# Altium schematic sheet [3] Gate_Drivers.SchDoc
size A4; SheetNumber: 4; SheetTotal: 5
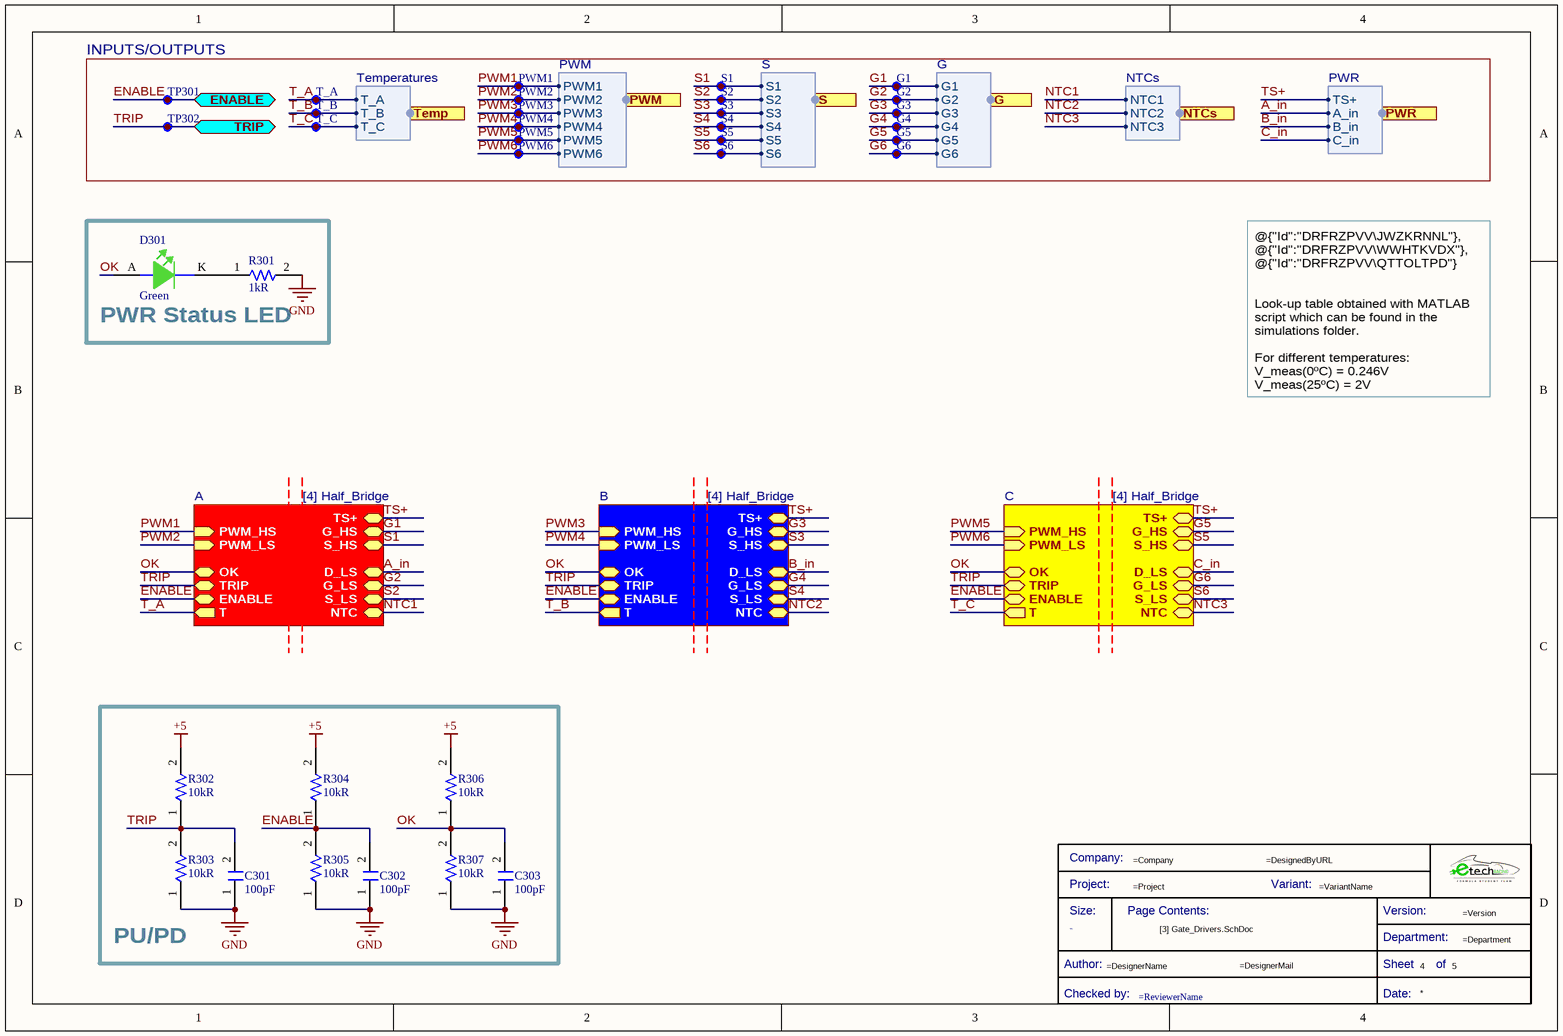
[diagram p0: [3] Gate_Drivers.SchDoc]

## Parts
*?  Title Block_template  (value not drawn)  (graphical)
C301  Capacitance: 100pF  [C0805FNPC-W]  (hidden comment: 885012007057)
C302  Capacitance: 100pF  [C0805FNPC-W]  (hidden comment: 885012007057)
C303  Capacitance: 100pF  [C0805FNPC-W]  (hidden comment: 885012007057)
D301  Color: Green  [LED_0805_WE]  (hidden comment: 150080GS75000)
G1  TestPoint  [TestPoint]  (value not drawn)  (no BOM)
G2  TestPoint  [TestPoint]  (value not drawn)  (no BOM)
G3  TestPoint  [TestPoint]  (value not drawn)  (no BOM)
G4  TestPoint  [TestPoint]  (value not drawn)  (no BOM)
G5  TestPoint  [TestPoint]  (value not drawn)  (no BOM)
G6  TestPoint  [TestPoint]  (value not drawn)  (no BOM)
PWM1  TestPoint  [TestPoint]  (value not drawn)  (no BOM)
PWM2  TestPoint  [TestPoint]  (value not drawn)  (no BOM)
PWM3  TestPoint  [TestPoint]  (value not drawn)  (no BOM)
PWM4  TestPoint  [TestPoint]  (value not drawn)  (no BOM)
PWM5  TestPoint  [TestPoint]  (value not drawn)  (no BOM)
PWM6  TestPoint  [TestPoint]  (value not drawn)  (no BOM)
R301  Resistance: 1kR  [R0805FTK]  (hidden comment: CR0805-JW-102ELF)
R302  Resistance: 10kR  [R0805FTK]  (hidden comment: CR0805-JW-103ELF)
R303  Resistance: 10kR  [R0805FTK]  (hidden comment: CR0805-JW-103ELF)
R304  Resistance: 10kR  [R0805FTK]  (hidden comment: CR0805-JW-103ELF)
R305  Resistance: 10kR  [R0805FTK]  (hidden comment: CR0805-JW-103ELF)
R306  Resistance: 10kR  [R0805FTK]  (hidden comment: CR0805-JW-103ELF)
R307  Resistance: 10kR  [R0805FTK]  (hidden comment: CR0805-JW-103ELF)
S1  TestPoint  [TestPoint]  (value not drawn)  (no BOM)
S2  TestPoint  [TestPoint]  (value not drawn)  (no BOM)
S3  TestPoint  [TestPoint]  (value not drawn)  (no BOM)
S4  TestPoint  [TestPoint]  (value not drawn)  (no BOM)
S5  TestPoint  [TestPoint]  (value not drawn)  (no BOM)
S6  TestPoint  [TestPoint]  (value not drawn)  (no BOM)
T_A  TestPoint  [TestPoint]  (value not drawn)  (no BOM)
T_B  TestPoint  [TestPoint]  (value not drawn)  (no BOM)
T_C  TestPoint  [TestPoint]  (value not drawn)  (no BOM)
TP301  TestPoint  [TestPoint]  (value not drawn)  (no BOM)
TP302  TestPoint  [TestPoint]  (value not drawn)  (no BOM)

## Blocks framed on the sheet
INPUTS/OUTPUTS: G1-G6 PWM1-PWM6 S1-S6 T_A T_B T_C TP301 TP302
PWR Status LED: D301 R301
PU/PD: C301-C303 R302-R307

## Sub-sheets
A = [4] Half_Bridge: PWM_HS (in), G_HS (bidir), S_HS (bidir), PWM_LS (in), G_LS (bidir), S_LS (bidir), NTC (bidir), OK (bidir), TRIP (bidir), ENABLE (bidir), T (out), D_LS (bidir), TS+ (bidir)
B = [4] Half_Bridge: PWM_HS (in), G_HS (bidir), S_HS (bidir), PWM_LS (in), G_LS (bidir), S_LS (bidir), NTC (bidir), OK (bidir), TRIP (bidir), ENABLE (bidir), T (out), TS+ (bidir), D_LS (bidir)
C = [4] Half_Bridge: PWM_HS (in), G_HS (bidir), S_HS (bidir), PWM_LS (in), G_LS (bidir), S_LS (bidir), NTC (bidir), OK (bidir), TRIP (bidir), ENABLE (bidir), T (out), TS+ (bidir), D_LS (bidir)

## Ports
ENABLE (bidir, see Inverter_Power[2C], [4] Half_Bridge[1B]), G (harness G, see Inverter_Power[3C], [1] Power_Stage[1C]), NTCs (harness NTCs, see Inverter_Power[3C], [1] Power_Stage[1B]), PWM (harness PWM, see Inverter_Power[2C]), PWR (harness PWR, see Inverter_Power[3B]), S (harness S, see Inverter_Power[3C], [1] Power_Stage[1C]), Temp (harness Temperatures, see Inverter_Power[2C]), TRIP (bidir, see Inverter_Power[2C], [4] Half_Bridge[1B])

## Harnesses
PWM: PWM1, PWM2, PWM3, PWM4, PWM5, PWM6
S: S1, S2, S3, S4, S5, S6
G: G1, G2, G3, G4, G5, G6
NTCs: NTC1, NTC2, NTC3
Temperatures: T_A, T_B, T_C
PWR: TS+, A_in, B_in, C_in

## Nets
+5: R302.2 R304.2 R306.2
GND: C301.1 C302.1 C303.1 R301.2 R303.1 R305.1 R307.1
A_in: sheet A/D_LS, port PWR.A_in
B_in: sheet B/D_LS, port PWR.B_in
C_in: sheet C/D_LS, port PWR.C_in
ENABLE: C302.2 R304.1 R305.2 TP301.1(TP) ; port ENABLE, sheet A/ENABLE, sheet B/ENABLE, sheet C/ENABLE
G1: G1.1(TP) ; sheet A/G_HS, port G.G1
G2: G2.1(TP) ; sheet A/G_LS, port G.G2
G3: G3.1(TP) ; sheet B/G_HS, port G.G3
G4: G4.1(TP) ; sheet B/G_LS, port G.G4
G5: G5.1(TP) ; sheet C/G_HS, port G.G5
G6: G6.1(TP) ; sheet C/G_LS, port G.G6
NTC1: sheet A/NTC, port NTCs.NTC1
NTC2: sheet B/NTC, port NTCs.NTC2
NTC3: sheet C/NTC, port NTCs.NTC3
OK: C303.2 D301.A R306.1 R307.2 ; sheet A/OK, sheet B/OK, sheet C/OK
PWM1: PWM1.1(TP) ; sheet A/PWM_HS, port PWM.PWM1
PWM2: PWM2.1(TP) ; sheet A/PWM_LS, port PWM.PWM2
PWM3: PWM3.1(TP) ; sheet B/PWM_HS, port PWM.PWM3
PWM4: PWM4.1(TP) ; sheet B/PWM_LS, port PWM.PWM4
PWM5: PWM5.1(TP) ; sheet C/PWM_HS, port PWM.PWM5
PWM6: PWM6.1(TP) ; sheet C/PWM_LS, port PWM.PWM6
S1: S1.1(TP) ; sheet A/S_HS, port S.S1
S2: S2.1(TP) ; sheet A/S_LS, port S.S2
S3: S3.1(TP) ; sheet B/S_HS, port S.S3
S4: S4.1(TP) ; sheet B/S_LS, port S.S4
S5: S5.1(TP) ; sheet C/S_HS, port S.S5
S6: S6.1(TP) ; sheet C/S_LS, port S.S6
T_A: T_A.1(TP) ; sheet A/T, port Temp.T_A
T_B: T_B.1(TP) ; sheet B/T, port Temp.T_B
T_C: T_C.1(TP) ; sheet C/T, port Temp.T_C
TRIP: C301.2 R302.1 R303.2 TP302.1(TP) ; port TRIP, sheet A/TRIP, sheet B/TRIP, sheet C/TRIP
TS+: sheet A/TS+, sheet B/TS+, sheet C/TS+, port PWR.TS+
NetD301_K: D301.K R301.1

## Notes on the sheet
- @{"Id":"DRFRZPVV\JWZKRNNL"}, @{"Id":"DRFRZPVV\WWHTKVDX"}, @{"Id":"DRFRZPVV\QTTOLTPD"}
  Look-up table obtained with MATLAB script which can be found in the simulations folder.
  For different temperatures:
  V_meas(0ºC) = 0.246V
  V_meas(25ºC) = 2V
  V_meas(50ºC) = 2.578V
  V_meas(90ºC) = 2.864V
- (in symbol Title Block_template) Company:; Project:; Variant:; Size:; Page Contents:; Version:; Department:; Author:; Sheet; of; Checked by:; Date:

## Library data of the parts
*? = Title Block_template: Standard Title Block; .Creator: GP; Category: Title Block; .PCBcheck: GP; .SCHcheck: GP; Checked by:: =ReviewerName; Size: -
C301-C303 = C100p-50V-0805FNPC-C0G/NP0: Multilayer Ceramic Capacitor, Wcap-Csgp Series, 100 Pf, 5%, C0G / Np0, 50 V, 0805 [2012 Metric] Rohs Compliant: Yes; Manufacturer: Wurth Electronics; Voltage Rating: 50V; .Creator: DR; Supplier 1: RSComponents; Manufacturer Part Number: 885012007057; RoHS: Yes; Category: Ceramic Capacitors; Stock 1: 1; Pricing 1: 4000=0,03900, 12000=0,03800 (USD); Mount: Surface Mount; Case/Package: 0805; Case Code (Metric): 2012; Case Code (Imperial): 0805; Min Operating Temperature: -55°C; Max Operating Temperature: 125°C; Packaging: Cut Tape; Dielectric: C0G; Tolerance: 5%; Voltage Rating (DC): 50V; Length: 0.079inch; Width: 0.049inch; Thickness: 0.035inch; REACH SVHC: Unknown; RoHS Compliant: Yes; ComponentLink1URL: http://www.farnell.com/datasheets/1958443.pdf?src-supplier=Farnell; ComponentLink1Description: http://www.farnell.com/datasheets/1958443.pdf?src-supplier=Farnell; ComponentLink2URL: https://katalog.we-online.de/pbs/datasheet/885012007057.pdf?src-supplier=Digi-Key; ComponentLink2Description: https://katalog.we-online.de/pbs/datasheet/885012007057.pdf?src-supplier=Digi-Key; ComponentLink3URL: http://www.farnell.com/datasheets/1958443.pdf?src-supplier=Element14; ComponentLink3Description: http://www.farnell.com/datasheets/1958443.pdf?src-supplier=Element14; ComponentLink4URL: http://www.farnell.com/datasheets/1958443.pdf?src-supplier=Newark; ComponentLink4Description: http://www.farnell.com/datasheets/1958443.pdf?src-supplier=Newark; ComponentLink5Description: Where buy it; ComponentLink5URL: https://www.we-online.com/catalog/en/WCAP-CSGP-50VDC#885012007057; Supplier Part Number 1: 1813930
D301 = LEDGS-0805-450: Led, Green, 520 Nm, 3.2 V, 30 Ma, 450 Mcd Rohs Compliant: Yes; Manufacturer 1: Wurth Electronics; Viewing Angle: 140°; Lens Style: Clear,Rectangular; Luminous Intensity: 450mcd; Forward Voltage: 3.2V; Wavelength: 520nm; Forward Current: 30mA; Test Current: 20mA; .Creator: GP; ComponentLink1Description: Datasheet; ComponentLink1URL: https://www.we-online.com/catalog/datasheet/150080GS75000.pdf; ComponentLink2Description: Where buy it; ComponentLink2URL: https://katalog.we-online.de/en/led/WL-SMCW/150080GS75000; Supplier 1: RSComponents; Manufacturer Part Number 1: 150080GS75000; RoHS: Yes; Category: LEDs; Stock 1: 4350; Pricing 1: 50=0,19300, 500=0,12900, 1000=0,12300, 2000=0,11700, 4000=0,11100 (USD); Mount: Surface Mount; Case/Package: 0805; Case Code (Metric): 2012; Case Code (Imperial): 0805; Min Operating Temperature: -40°C; Max Operating Temperature: 85°C; Package Quantity: 4000; Packaging: Cut Tape; Dominant Wavelength: 520nm; Length: 2mm; Width: 1.25mm; Height: 0.7mm; REACH SVHC: Unknown; RoHS Compliant: Yes; ComponentLink3URL: https://datasheet.ciiva.com/29563/150080gs75000-29563008.pdf?src-supplier=Digi-Key; ComponentLink3Description: https://datasheet.ciiva.com/29563/150080gs75000-29563008.pdf?src-supplier=Digi-Key; ComponentLink4URL: https://datasheet.ciiva.com/29279/759434-da-01-en-chipled-0805-w-kl-gruen-150080gs75000-29279039.pdf?src-supplier=Conrad; ComponentLink4Description: https://datasheet.ciiva.com/29279/759434-da-01-en-chipled-0805-w-kl-gruen-150080gs75000-29279039.pdf?src-supplier=Conrad; Supplier Part Number 1: 8154221
G1-G6 PWM1-PWM6 S1-S6 T_A T_B T_C TP301 TP302 = TestPoint: Test Point 1x1 mm; .Creator: GP; Category: TestPoint; .PCBcheck: GP; .SCHcheck: GP
R301 = R1k-0805FTK: Res Thick Film 0805 1K Ohm 5% 1/8W ±200ppm/°C Molded SMD SMD Paper Tape on Plastic Reel; Manufacturer 1: Bourns; Voltage Rating (DC): 150V; Power Rating: 125mW; .Creator: GP; Supplier 1: Arrow Electronics; Manufacturer Part Number 1: CR0805-JW-102ELF; RoHS: Yes; Category: Chip SMD Resistors; Stock 1: 27510; Pricing 1: 1=0,05930, 10=0,03510, 25=0,01790, 100=0,00800, 250=0,00790, 500=0,00590, 1000=0,00360, 3000=0,00350, 6000=0,00250 (USD); Mount: Surface Mount; Case/Package: 0805; Number of Pins: 2; Contact Plating: Tin; Case Code (Metric): 2012; Case Code (Imperial): 0805; Min Operating Temperature: -55°C; Max Operating Temperature: 155°C; Resistor Type: Thick Film; Tolerance: 5%; Temperature Coefficient: 200ppm/°C; Features: Moisture Resistant; Package Quantity: 1; Packaging: Tape and Reel; Voltage Rating: 150V; Number of Terminations: 2; Termination: SMD/SMT; Max Power Dissipation: 125mW; Length: 2mm; Width: 1.25mm; Height: 0.5mm; Thickness: 508um; Depth: 1.25mm; Radiation Hardening: No; Lead Free: Lead Free; REACH SVHC: No SVHC; Military Standard: Not; ComponentLink1URL: https://datasheet.ciiva.com/11821/0900766b80fcdb72-11821134.pdf?src-supplier=RSComponents; ComponentLink1Description: https://datasheet.ciiva.com/11821/0900766b80fcdb72-11821134.pdf?src-supplier=RSComponents; ComponentLink2URL: https://datasheet.ciiva.com/15225/getdatasheetpartid-78155-15225381.pdf?src-supplier=Verical; ComponentLink2Description: https://datasheet.ciiva.com/15225/getdatasheetpartid-78155-15225381.pdf?src-supplier=Verical; ComponentLink3URL: https://datasheet.ciiva.com/22693/1902866-22693253.pdf?src-supplier=Element14; ComponentLink3Description: https://datasheet.ciiva.com/22693/1902866-22693253.pdf?src-supplier=Element14; ComponentLink4URL: https://datasheet.ciiva.com/7986/1856384-7986184.pdf?src-supplier=Element14; ComponentLink4Description: https://datasheet.ciiva.com/7986/1856384-7986184.pdf?src-supplier=Element14; ComponentLink5URL: https://datasheet.ciiva.com/7985/1856384-7985867.pdf?src-supplier=Element14; ComponentLink5Description: https://datasheet.ciiva.com/7985/1856384-7985867.pdf?src-supplier=Element14; ComponentLink6URL: https://datasheet.ciiva.com/30242/159chpreztr-30242765.pdf?src-supplier=Onlinecomponents.com; ComponentLink6Description: https://datasheet.ciiva.com/30242/159chpreztr-30242765.pdf?src-supplier=Onlinecomponents.com; ComponentLink7URL: https://datasheet.ciiva.com/6547/chpreztr-6547359.pdf?src-supplier=Digi-Key; ComponentLink7Description: https://datasheet.ciiva.com/6547/chpreztr-6547359.pdf?src-supplier=Digi-Key; Supplier Part Number 1: CR0805-JW-102ELF
R302-R307 = R10k-0805FTK: BOURNS         CR0805-JW-103ELF            Surface Mount Chip Resistor, Thick Film, CR Series, 10 kohm, 125 mW,  5%, 150 V; Temperature Coefficient: 200ppm/°C; Power Rating: 125mW; Voltage Rating: 150V; Voltage Rating (DC): 100V; .Creator: DR; Supplier 1: Arrow Electronics; Manufacturer 1: Bourns; Manufacturer Part Number 1: CR0805-JW-103ELF; RoHS: Yes; Category: Chip SMD Resistors; Stock 1: 57566; Pricing 1: 1=0,05790, 10=0,01540, 25=0,01340, 100=0,00340 (USD); Mount: Surface Mount; Case/Package: 0805; Number of Pins: 2; Contact Plating: Tin; Case Code (Metric): 2012; Case Code (Imperial): 0805; Min Operating Temperature: -55°C; Max Operating Temperature: 155°C; Tolerance: 5%; Resistor Type: Thick Film; Package Quantity: 1; Packaging: Tape and Reel; Number of Terminations: 2; Termination: SMD/SMT; Max Power Dissipation: 125mW; Features: Moisture Resistant; Series: CR0805; Construction: Rectangular; Resistance Tolerance: 5%; Technology: THICK FILM; Length: 2mm; Width: 1.25mm; Height: 0.5mm; Depth: 1.25mm; Thickness: 508um; Radiation Hardening: No; REACH SVHC: No SVHC; Military Standard: Not; RoHS Compliant: Yes; ComponentLink1URL: https://datasheet.ciiva.com/11821/0900766b80fcdb72-11821135.pdf?src-supplier=RSComponents; ComponentLink1Description: https://datasheet.ciiva.com/11821/0900766b80fcdb72-11821135.pdf?src-supplier=RSComponents; ComponentLink2URL: https://datasheet.ciiva.com/9122/chpreztr-9122374.pdf?src-supplier=Avnet; ComponentLink2Description: https://datasheet.ciiva.com/9122/chpreztr-9122374.pdf?src-supplier=Avnet; ComponentLink3URL: https://datasheet.ciiva.com/22693/1902866-22693254.pdf?src-supplier=Element14; ComponentLink3Description: https://datasheet.ciiva.com/22693/1902866-22693254.pdf?src-supplier=Element14; ComponentLink4URL: https://datasheet.ciiva.com/7986/691949-7986187.pdf?src-supplier=Element14; ComponentLink4Description: https://datasheet.ciiva.com/7986/691949-7986187.pdf?src-supplier=Element14; ComponentLink5URL: https://datasheet.ciiva.com/30065/159chpreztr-30065976.pdf?src-supplier=Onlinecomponents.com; ComponentLink5Description: https://datasheet.ciiva.com/30065/159chpreztr-30065976.pdf?src-supplier=Onlinecomponents.com; ComponentLink6URL: https://datasheet.ciiva.com/16783/70154685-16783482.pdf?src-supplier=Allied+Electronics; ComponentLink6Description: https://datasheet.ciiva.com/16783/70154685-16783482.pdf?src-supplier=Allied+Electronics; ComponentLink7URL: https://datasheet.ciiva.com/5548/chpreztr-5548491.pdf?src-supplier=Mouser; ComponentLink7Description: https://datasheet.ciiva.com/5548/chpreztr-5548491.pdf?src-supplier=Mouser; ComponentLink8URL: https://datasheet.ciiva.com/6559/chpreztr-6559900.pdf?src-supplier=Digi-Key; ComponentLink8Description: https://datasheet.ciiva.com/6559/chpreztr-6559900.pdf?src-supplier=Digi-Key; ComponentLink9URL: https://datasheet.ciiva.com/6559/chpreztr-6559901.pdf?src-supplier=Digi-Key; ComponentLink9Description: https://datasheet.ciiva.com/6559/chpreztr-6559901.pdf?src-supplier=Digi-Key; ComponentLink10URL: https://datasheet.ciiva.com/7985/1856384-7985869.pdf?src-supplier=Element14; ComponentLink10Description: https://datasheet.ciiva.com/7985/1856384-7985869.pdf?src-supplier=Element14; ComponentLink11URL: https://datasheet.ciiva.com/48692/001055517-da-01-en-smd-wid-cr0805-jw-103elf-10k-ohm-1-8w-48692118.pdf?src-supplier=Conrad; ComponentLink11Description: https://datasheet.ciiva.com/48692/001055517-da-01-en-smd-wid-cr0805-jw-103elf-10k-ohm-1-8w-48692118.pdf?src-supplier=Conrad; Supplier Part Number 1: CR0805-JW-103ELF